# EAGLE design myPlant (EAGLE 8.2.1)
Plant watering alarm v2.4
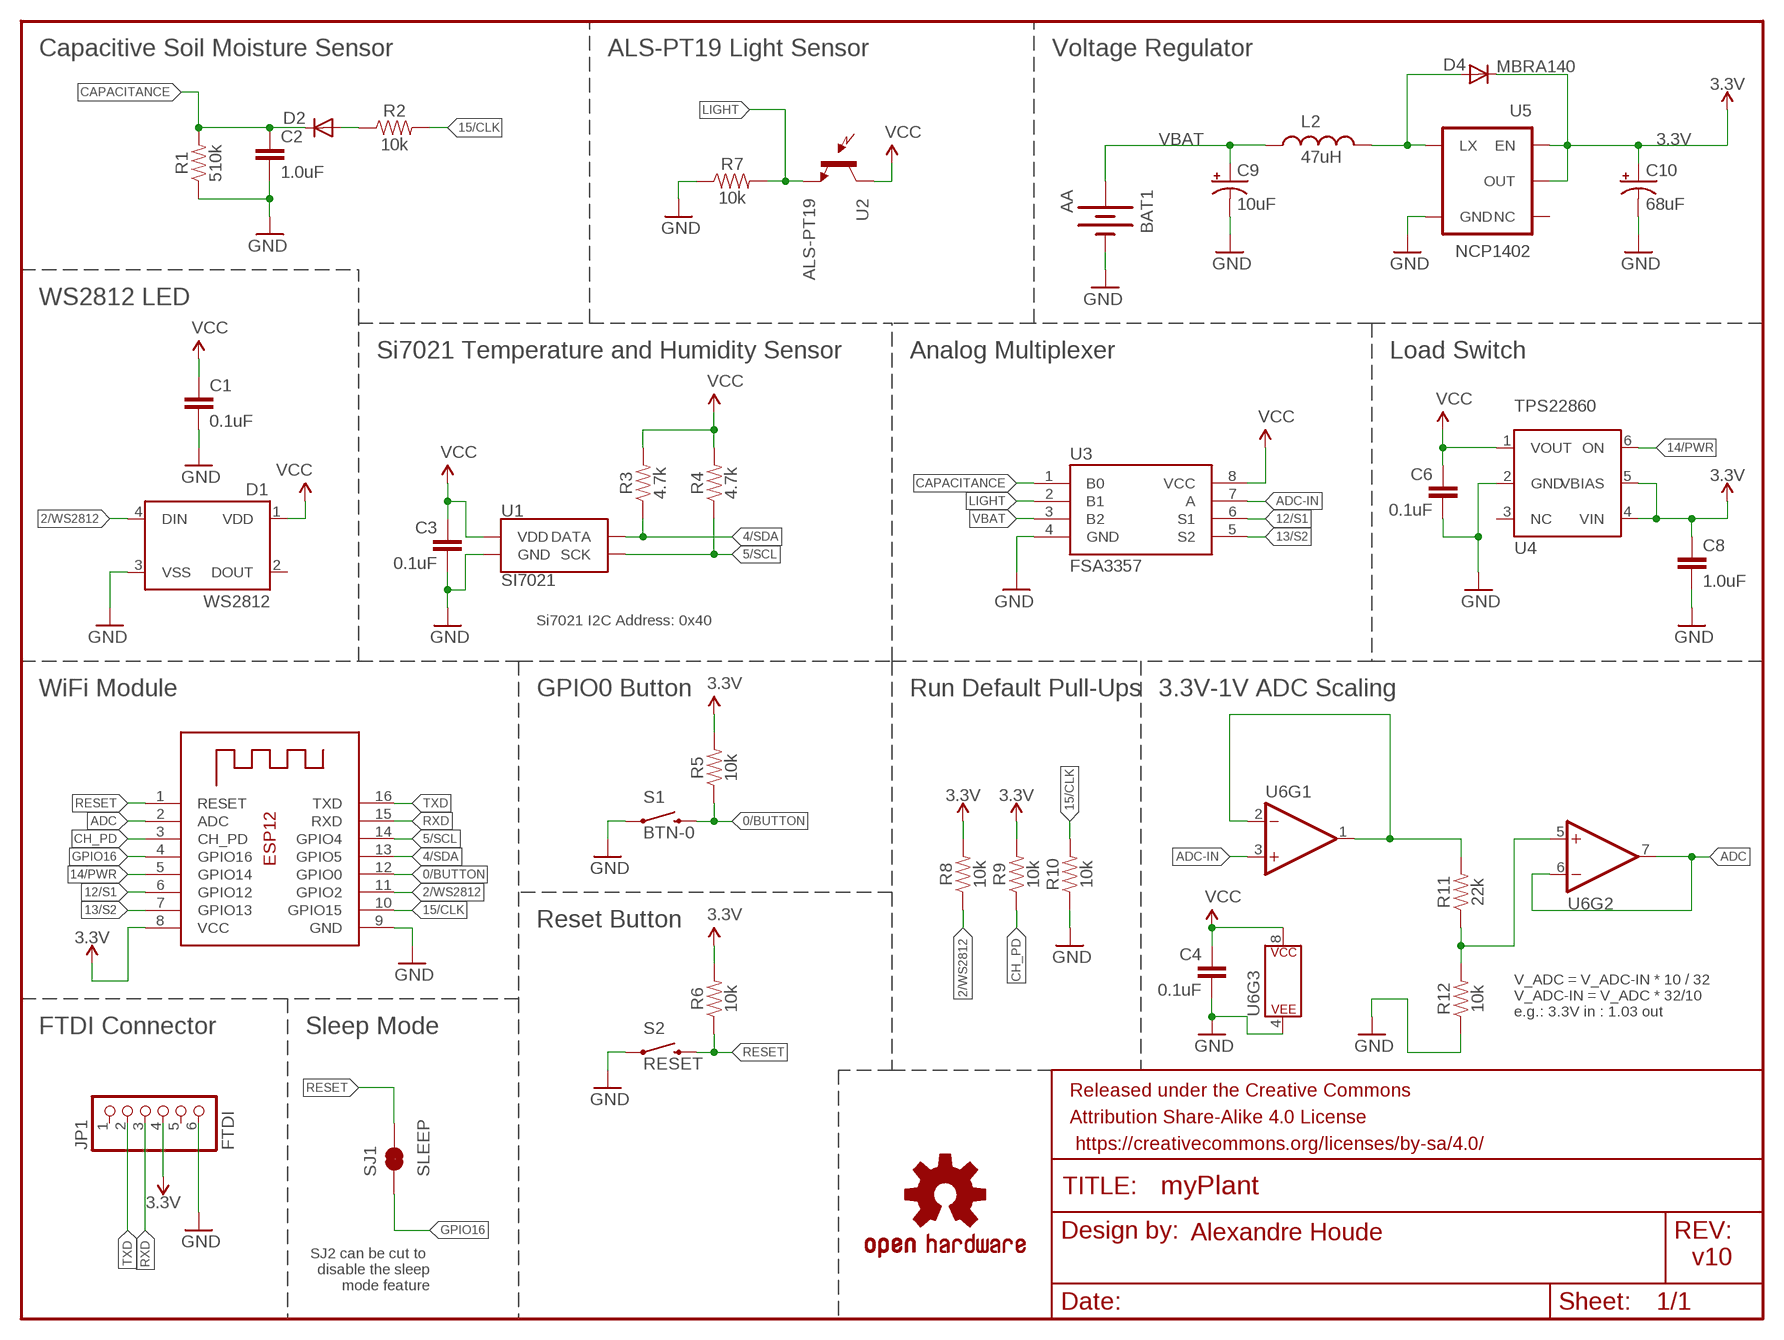
[diagram p0: schematic, sheet 1]

## Parts
BAT1  AA  BATTERYAA-KIT  [BATTERY-AA-KIT]
C1  0.1uF  0.1UF-0603-25V-(+80/-20%)  [0603]
C2  1.0uF  1.0UF-0603-16V-10%  [0603]
C3  0.1uF  0.1UF-0603-25V-(+80/-20%)  [0603]
C4  0.1uF  0.1UF-0603-25V-(+80/-20%)  [0603]
C6  0.1uF  0.1UF-0603-25V-(+80/-20%)  [0603]
C8  1.0uF  1.0UF-0603-16V-10%  [0603]
C9  10uF  CAP_POL1206  [EIA3216]
C10  68uF  CAP_POL3528  [EIA3528]
D1  WS2812  WS2812B  [WS2812B]
D2  DIODE-SCHOTTKY_  DIODESOD-523  [SOD-523]
D4  MBRA140  DIODESMA  [SMA-DIODE]
FRAME1  FRAME-LETTER  [CREATIVE_COMMONS]
JP1  FTDI  HEADER-1X670MIL  [1X06_ROUND_70]
L2  47uH  INDUCTORCR54  [CR54]
LOGO1  OSHW-LOGOM  [OSHW-LOGO-M]
R1  510k  10KOHM-0603-1/10W-1%  [0603]
R2  10k  10KOHM-0603-1/10W-1%  [0603]
R3  4.7k  4.7KOHM-0603-1/10W-1%  [0603]
R4  4.7k  4.7KOHM-0603-1/10W-1%  [0603]
R5  10k  10KOHM-0603-1/10W-1%  [0603]
R6  10k  10KOHM-0603-1/10W-1%  [0603]
R7  10k  10KOHM-0603-1/10W-1%  [0603]
R8  10k  10KOHM-0603-1/10W-1%  [0603]
R9  10k  10KOHM-0603-1/10W-1%  [0603]
R10  10k  10KOHM-0603-1/10W-1%  [0603]
R11  22k  22KOHM-0603-1/10W-1%  [0603]
R12  10k  10KOHM-0603-1/10W-1%  [0603]
S1  BTN-0  SWITCH-MOMENTARY-2SMD-4.6X2.8MM  [TACTILE_SWITCH_SMD_4.6X2.8MM]
S2  RESET  SWITCH-MOMENTARY-2SMD-4.6X2.8MM  [TACTILE_SWITCH_SMD_4.6X2.8MM]
SJ1  SLEEP  JUMPER-PAD-2-NC_BY_TRACE  [PAD-JUMPER-2-NC_BY_TRACE_YES_SILK]
U1  SI7021  [DFN-6-3X3-SI7021]
U2  ALS-PT19  LIGHTSENSORALS  [ALS-PT19]
U3  FSA3357  [US8]
U4  TPS22860  [SOT23-6]
U5  NCP1402  V_REG_NCP1400SOT23-5  [SOT23-5]
U6  LMV358  [MSOP8]
X1  ESP-12  [ESP-12]

## Nets
0/BUTTON: R5.1 S1.3 S1.4 X1.12(GPIO0)
2/WS2812: D1.4(DIN) R8.1 X1.11(GPIO2)
3.3V: C8.1 C10.A(+) D4.C JP1.4 R5.2 R6.2 R8.2 R9.2 U4.4(VIN) U4.5(VBIAS) U5.1(EN) U5.2(OUT) X1.8(VCC)
4/SDA: R3.1 U1.DATA X1.13(GPIO5)
5/SCL: R4.1 U1.SCK X1.14(GPIO4)
12/S1: U3.6(S1) X1.6(GPIO12)
13/S2: U3.5(S2) X1.7(GPIO13)
14/PWR: U4.6(ON) X1.5(GPIO14)
15/CLK: R2.2 R10.2 X1.10(GPIO15)
ADC: U6.6(-IN) U6.7(OUT) X1.2(ADC)
ADC-IN: U3.7(A) U6.3(+IN)
CAPACITANCE: C2.1 D2.K(C) R1.2 U3.1(B0)
CH_PD: R9.1 X1.3(CH_PD)
GND: BAT1.GND@1(-) C1.2 C2.2 C3.2 C4.2 C6.2 C8.2 C9.C(-) C10.C(-) D1.3(VSS) JP1.6 R1.1 R7.1 R10.1 R12.1 S1.1 S1.2 S2.1 S2.2 U1.GND U3.4(GND) U4.2(GND) U5.4(GND) U6.4(P$V-) X1.9(GND)
GPIO16: SJ1.1 X1.4(GPIO16)
LIGHT: R7.2 U2.E(E1) U3.2(B1)
N$3: D4.A L2.P$2 U5.5(LX)
N$15: R11.2 U6.1(OUT) U6.2(-IN)
N$18: R11.1 R12.2 U6.5(+IN)
RESET: R6.1 S2.3 S2.4 SJ1.2 X1.1(RESET)
RXD: JP1.3 X1.15(RXD)
TXD: JP1.2 X1.16(TXD)
V_CAP: D2.A R2.1
VBAT: BAT1.PWR@1(+) C9.A(+) L2.P$1 U3.3(B2)
VCC: C1.1 C3.1 C4.1 C6.1 D1.1(VDD) R3.2 R4.2 U1.VDD U2.C(C1) U3.8(VCC) U4.1(VOUT) U6.8(P$V+)
Unconnected: D1.2(DOUT) JP1.1 JP1.5 U4.3(NC) U5.3(NC)

## Notes on the sheet
- Capacitive Soil Moisture Sensor | ALS-PT19 Light Sensor | Voltage Regulator
- WS2812 LED
- Si7021 Temperature and Humidity Sensor | Analog Multiplexer | Load Switch
- Si7021 I2C Address: 0x40
- WiFi Module | GPIO0 Button | Run Default Pull-Ups | 3.3V-1V ADC Scaling
- Reset Button
- V_ADC = V_ADC-IN * 10 / 32
  V_ADC-IN = V_ADC * 32/10
  e.g.: 3.3V in : 1.03 out
- FTDI Connector | Sleep Mode
- Alexandre Houde
- SJ2 can be cut to 
  disable the sleep
  mode feature
- v10

## Library data of the parts
BAT1 = SparkFun:BATTERY: Battery Holders Various common sizes : AA, AAA, 20mm coin cell and 12mm coin cell.
C1 C3 C4 C6 = SparkFun-Capacitors:0.1UF: 0.1µF ceramic capacitors A capacitor is a passive two-terminal electrical component used to store electrical energy temporarily in an electric field.; PROD_ID: CAP-00810
C2 C8 = SparkFun-Capacitors:1.0UF: 1µF ceramic capacitors A capacitor is a passive two-terminal electrical component used to store electrical energy temporarily in an electric field.; PROD_ID: CAP-00868
C9 C10 = SparkFun:CAP_POL: Capacitor Polarized These are standard SMD and PTH capacitors. Normally 10uF, 47uF, and 100uF in electrolytic and tantalum varieties. Always verify the external diameter of the through hole cap, it varies with capacity, voltage, and manufacturer. The EIA devices should be standard.
D1 = SparkFun-LED:WS2812B: WS2812B - Intelligent control LED integrated light source Technical Specifications: Power Supply Voltage (VDD): 3.5 to 5.3 V Input Voltage (VI): -0.5 to VDD+0.5 V Operating Junction Temperature (Topt): -25°C to +80°C Storage Temperature Range (Tstg): -55°C to +150°C; PROD_ID: DIO-12503
D2 = microbuilder:DIODE: Diode
D4 = SparkFun:DIODE: Diode
FRAME1 = SparkFun-Aesthetics:FRAME-LETTER: Schematic Frame - Letter Standard 8.5x11 US Letter frame
JP1 = microbuilder:HEADER-1X6: PIN HEADER
L2 = SparkFun:INDUCTOR: Inductors Basic Inductor/Choke - 0603 and 1206. Footprints are not proven and vary greatly between part numbers.
LOGO1 = SparkFun-Aesthetics:OSHW-LOGO: Open-Source Hardware (OSHW) Logo This logo indicates the piece of hardware it is found on incorporates a OSHW license and/or adheres to the definition of open source hardware found here: http://freedomdefined.org/OSHW
R1 = SparkFun-Resistors:10KOHM: 10kΩ resistor A resistor is a passive two-terminal electrical component that implements electrical resistance as a circuit element. Resistors act to reduce current flow, and, at the same time, act to lower voltage levels within circuits. - Wikipedia; PROD_ID: RES-00824; VALUE: 10k
R2 R5-R10 R12 = SparkFun-Resistors:10KOHM: 10kΩ resistor A resistor is a passive two-terminal electrical component that implements electrical resistance as a circuit element. Resistors act to reduce current flow, and, at the same time, act to lower voltage levels within circuits. - Wikipedia; PROD_ID: RES-00824
R3 R4 = SparkFun-Resistors:4.7KOHM: 4.7kΩ resistor A resistor is a passive two-terminal electrical component that implements electrical resistance as a circuit element. Resistors act to reduce current flow, and, at the same time, act to lower voltage levels within circuits. - Wikipedia; PROD_ID: RES-07857
R11 = SparkFun-Resistors:22KOHM: 22kΩ resistor A resistor is a passive two-terminal electrical component that implements electrical resistance as a circuit element. Resistors act to reduce current flow, and, at the same time, act to lower voltage levels within circuits. - Wikipedia; PROD_ID: RES-07853
S1 S2 = SparkFun-Electromechanical:SWITCH-MOMENTARY-2: Various NO switches- pushbuttons, reed, etc; PROD_ID: SWCH-13065
SJ1 = SparkFun-Passives:JUMPER-PAD-2-NC_BY_TRACE
U1 = SparkFun-Sensors:SI7021: Silicon Labs Si7021 I2C Humidity and Temperature Sensor The Si7021 is a low-cost, easy-to-use, highly accurate, digital humidity and temperature sensor. This sensor is ideal for environmental sensing and data logging and perfect for build a weather stations or humidor control system. All you need are two lines for I2C communication, and you’ll have relative humidity readings and very accurate temperature readings as a bonus! Datasheet <https://cdn.sparkfun.com/datasheets/Sensors/Weather/Si7021.pdf> SparkFun Products SparkFun Humidity and Temperature Sensor Breakout - Si7021 <https://www.sparkfun.com/products/13763> (SEN-13763) SparkFun Blynk Board - ESP8266 <https://www.sparkfun.com/products/13794> (WRL-13794); PROD_ID: IC-13093
U2 = SparkFun-Sensors:LIGHTSENSOR: Ambient Light Sensor Simple light detection sensor. Output varies with light intensity input. Spark Fun Electronics SKU : COM-08348; PROD_ID: IC-11836
U3 = alex:FSA3357
U4 = alex:TPS22860
U5 = SparkFun:V_REG_NCP1400: Switching step-up voltage regulator NCP1400 switiching regulator takes single cell AA and outputs 100mA at 3.3V or 5V with minimal number of external components.
U6 = SparkFun-IC-Amplifiers:LMV358: IC LMV358 DUAL OP AMP Jellybean rail-to-rail output op-amp SparkFun Products SparkFun PicoBoard <https://www.sparkfun.com/products/11888> (WIG-11888) SparkFun Vernier Interface Shield <https://www.sparkfun.com/products/12858> (DEV-12858) SparkFun Blynk Board - ESP8266 <https://www.sparkfun.com/products/13794> (WRL-13794) SparkFun Digital Sandbox <https://www.sparkfun.com/products/12651> (DEV-12651 RoHS)
X1 = microbuilder:ESP-12

## Net classes
1 vcc: width 0.203 mm

## Board
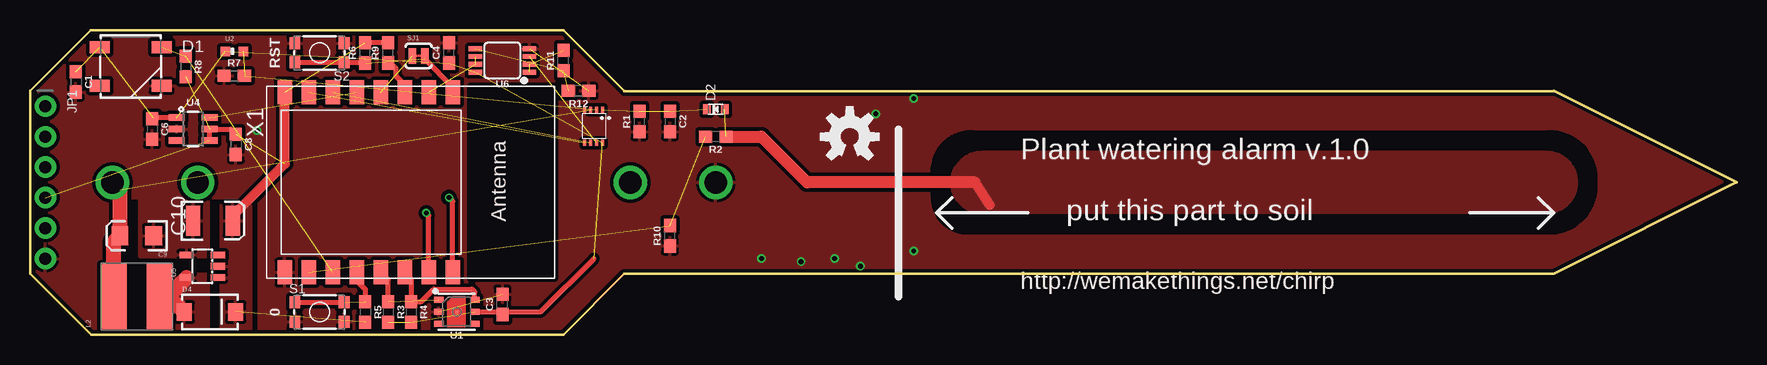
[diagram p1: board, top side]
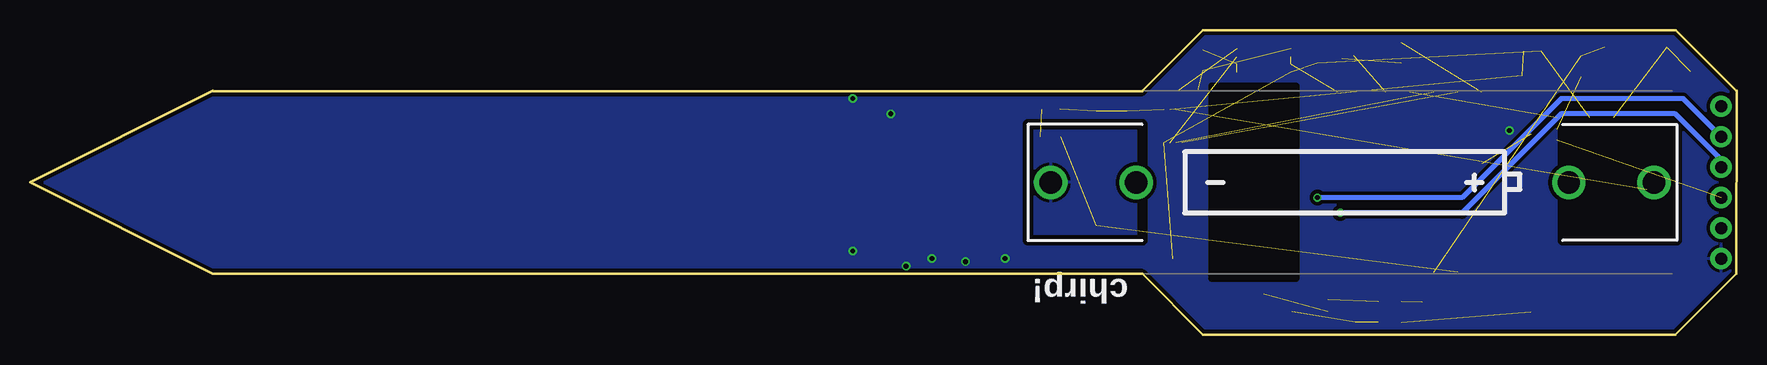
[diagram p2: board, bottom side, seen from below]

Size 142.25 x 25.4 mm. Coordinates in mm from the lower left corner, seen from the top.
Outline: 127.01,20.31 49.54,20.31
Outline: 5.1,25.4 44.46,25.4 49.54,20.33
Outline: 5.1,0 44.47,0 49.54,5.08 127.01,5.08 142.24,12.7
Outline: 142.25,12.71 127.01,20.32
Outline: 5.09,0.01 0.01,5.08 0,20.32
Outline: 5.08,25.4 0.01,20.32
Copper layers (1*16): Top 0.035mm / dielectric 1.5mm / Bottom 0.035mm
Design rules "Fusion_eagle_rule_v1.1": minimum track width 6mil, minimum drill 12mil, track to track 6mil, track to pad 6mil, pad to pad 6mil, via to via 6mil, smd to smd 0mil, copper to edge 10mil, drill to drill 10mil, minimum pad ring 10mil, minimum via ring 6mil, stop-mask expansion 2mil, vias tented up to drill 100mil, thermal gap 10mil

### Footprints (pad centres in the part's own frame; a part is rotated, then mirrored left to right if it is on the bottom)
BATTERY-AA-KIT = drill 1.854: GND@1 25.146,0; GND@2 18.034,0; PWR@1 -25.146,0; PWR@2 -18.034,0
0603 = smd 1.1 x 1: 1 -0.85,0; 2 0.85,0
EIA3216 = smd 1.4 x 1.6: A 1.4,0; C -1.4,0
EIA3528 = smd 1.2 x 2.5: A 1.65,0; C -1.65,0
WS2812B = smd 1.651 x 1: 1 -2.577,1.6; 2 -2.577,-1.6; 3 2.577,-1.6; 4 2.577,1.6
SOD-523 = smd 0.8 x 0.6: A 0,-0.75; K 0,0.75
SMA-DIODE = smd 1.27 x 1.47: A -2.15,0; C 2.15,0
1X06_ROUND_70 = drill 1 pad 1.778: 1 -6.35,0; 2 -3.81,0; 3 -1.27,0; 4 1.27,0; 5 3.81,0; 6 6.35,0
CR54 = smd 5.5 x 2.15: P$1 0,1.92; P$2 0,-1.92
TACTILE_SWITCH_SMD_4.6X2.8MM = smd 0.9 x 1: 1 -2.05,-0.8; 2 2.05,-0.8; 3 2.05,0.8; 4 -2.05,0.8
PAD-JUMPER-2-NC_BY_TRACE_YES_SILK = smd 0.635 x 1.27: 1 -0.508,0; 2 0.508,0
DFN-6-3X3-SI7021 = smd 0.2 x 0.2: 7 0,0 | smd 0.8 x 0.5: DATA 1.5,-1; GND 1.5,0; NC@3 1.5,1; NC@4 -1.5,1; SCK -1.5,-1; VDD -1.5,0
ALS-PT19 = smd 0.8 x 0.8: C -0.75,0; E 0.75,0
US8 = smd 0.25 x 0.5: 1 -0.73,-1.37; 2 -0.23,-1.37; 3 0.27,-1.37; 4 0.77,-1.37; 5 0.77,1.38; 6 0.27,1.38; 7 -0.23,1.38; 8 -0.73,1.38
SOT23-6 = smd 0.55 x 1.35: 1 -0.95,-1.375; 2 0,-1.375; 3 0.95,-1.375; 4 0.95,1.375; 5 0,1.375; 6 -0.95,1.375
SOT23-5 = smd 0.55 x 1.2: 1 -0.95,-1.3; 2 0,-1.3; 3 0.95,-1.3; 4 0.95,1.3; 5 -0.95,1.3
MSOP8 = smd 0.4 x 1.1: 1 -0.975,-2.25; 2 -0.325,-2.25; 3 0.325,-2.25; 4 0.975,-2.25; 5 0.975,2.25; 6 0.325,2.25; 7 -0.325,2.25; 8 -0.975,2.25
ESP-12 = smd 2 x 1.2: 1 -7.5,4.5; 2 -7.5,2.5; 3 -7.5,0.5; 4 -7.5,-1.5; 5 -7.5,-3.5; 6 -7.5,-5.5; 7 -7.5,-7.5; 8 -7.5,-9.5; 9 7.5,-9.5; 10 7.5,-7.5; 11 7.5,-5.5; 12 7.5,-3.5; 13 7.5,-1.5; 14 7.5,0.5; 15 7.5,2.5; 16 7.5,4.5

### Placement (x,y rotation side)
BAT1  32.01,12.7 180 bottom
C1  3.82,21.08 270 top
C2  53.35,17.78 270 top
C3  39.38,2.54 90 top
C4  34.93,23.5 90 top
C6  10.17,17.14 270 top
C8  17.16,15.88 270 top
C9  8.9,8.26 180 top
C10  15.25,9.53 0 top
D1  8.39,22.35 0 top
D2  57.16,18.8 90 top
D4  15,1.91 0 top
FRAME1  28.46,-9.14 0 top  (outside the outline)
JP1  1.28,12.7 270 top
L2  8.9,3.17 90 top
LOGO1  68.34,16.51 0 top
R1  50.81,17.78 90 top
R2  57.16,16.51 180 top
R3  29.86,1.91 270 top
R4  31.76,1.91 270 top
R5  27.95,1.91 270 top
R6  27.95,23.5 90 top
R7  17.03,21.59 0 top
R8  12.96,22.35 270 top
R9  29.86,23.5 90 top
R10  53.35,8.26 90 top
R11  44.46,22.86 90 top
R12  45.73,20.32 180 top
S1  24.14,1.91 0 top
S2  24.14,23.5 180 top
SJ1  32.39,23.24 0 top
U1  35.57,1.91 180 top
U2  17.03,23.62 0 top
U3  47,17.4 180 top
U4  13.6,17.14 270 top
U5  14.36,5.71 90 top
U6  39.38,22.86 90 top
X1  30.74,12.7 270 top

### Tracks (layer width: path | path; a pad name or v marks a point on that pad's centre or on a via)
0/BUTTON  (1 unrouted)
  Top 0.406: S1.4 S1.3 | X1.12 27.24,4.52 27.95,3.81 R5.1
2/WS2812  (2 unrouted)
3.3V  (5 unrouted)
  Top 0.406: C8.1 16.74,17.14 U4.5 U4.4 | R9.2 R6.2
  Top 0.813: X1.8 21.24,14.25 16.9,9.9 C10.A
  pour Top (isolate 0.305): 18.43,0 18.43,10.79 15.88,10.79 15.88,0
4/SDA  (1 unrouted)
  Top 0.406: R3.1 29.86,4.59 X1.13
5/SCL
  Top 0.406: X1.14 31.76,4.68 R4.1 32.61,2.75 33.66,3.81 36.84,3.81 37.07,3.58 U1.SCK
12/S1  (1 unrouted)
13/S2  (1 unrouted)
14/PWR  (1 unrouted)
15/CLK  (2 unrouted)
ADC  (2 unrouted)
ADC-IN  (1 unrouted)
CAPACITANCE  (3 unrouted)
CH_PD
  Top 0.406: X1.3 31.24,20.84 30.49,21.59 30.49,22.23 30.07,22.64 R9.1
GND  (via drill 0.4, 0.4 pad 0.3)  (2 unrouted)
  other vias: 64.27,6.1 67.07,6.35 18.93,17.02 60.97,6.35 70.5,18.41 69.23,5.71 73.67,19.68 73.67,6.99
  pour Top (isolate 0.305): 19.06,25.39 19.06,0 74.94,0 74.94,25.39
  pour Bottom (isolate 0.305): 55.89,20.31 126.68,20.31 142.25,12.7 127.01,5.08 55.89,5.08
  pour Top (isolate 0.305, no thermals): 74.94,20.31 126.68,20.31 142.25,12.7 127.01,5.08 74.94,5.08 74.94,11.43 arc90 78.12,8.26 126.38,8.26 arc90 130.82,12.06 130.82,13.34 arc90 126.38,17.14 78.75,17.14 arc90 74.94,13.97
  pour Top (isolate 0.305): 14.87,14.61 14.87,6.48 9.15,6.48 9.15,14.61
  pour Top (isolate 0.305): 0.01,11.43 20.33,11.43 20.33,25.4 0.01,25.4
  pour Top (isolate 0.305): 0.01,0 8.27,0 8.27,12.7 0.01,12.7
  pour Bottom (isolate 0.305): 72.4,0 0.01,0 0.01,25.4 72.4,25.4
GPIO16  (1 unrouted)
LIGHT  (2 unrouted)
N$3
  Top 1.27: D4.A 11.58,3.17 L2.P$2 11.47,3.17 U5.5
  pour Top (isolate 0.305): 14.87,5.08 14.87,0 10.17,0 10.17,5.08
N$15  (2 unrouted)
N$18  (2 unrouted)
RESET  (1 unrouted)
  Top 0.406: X1.1 35.24,20.65 32.9,22.99 SJ1.2 | S2.3 S2.4 27.9,22.7 R6.1
RXD  (via drill 0.38)
  Top 0.406: X1.15 33.24,9.95 v33.03,10.16
  Bottom 0.406: JP1.3 1.28,14.61 5.09,18.41 14.62,18.41 22.87,10.16 v33.03,10.16
TXD  (via drill 0.38)
  Top 0.406: X1.16 35.24,11.12 v34.93,11.43
  Bottom 0.406: v34.93,11.43 22.87,11.43 14.62,19.68 4.46,19.68 JP1.2
V_CAP  (1 unrouted)
  Top 0.813: 80,10.82 78.75,12.7
  Top 1.016: 78.75,12.7 64.78,12.7 60.97,16.51 R2.1
  pour Top (no thermals): 76.84,12.7 arc-90 79.39,15.24 126.38,15.24 arc-90 128.91,12.7 arc-90 126.38,10.16 79.39,10.16 arc-90
VBAT  (1 unrouted)
  Top 1.27: L2.P$1 6.98,7.74 C9.A 7.5,12.07 BAT1.PWR@1
  Top 1.524: 7,3.19 L2.P$1
VCC  (9 unrouted)
  Top 0.406: U1.VDD 39.16,1.91 | 39.16,1.91 C3.1 | U4.1 10.27,18.09 C6.1 | 39.16,1.91 42.55,1.91 47,6.35

### Text on the board
tPlace: RST | 0
tNames: Plant watering alarm v.1.0 | put this part to soil | http://wemakethings.net/chirp
bNames: chirp!
_tsilk: CERN OHL | v.1.1 | ISP